# Altium schematic sheet Sheet2.SchDoc
size A0; SheetNumber: 1; SheetTotal: 1
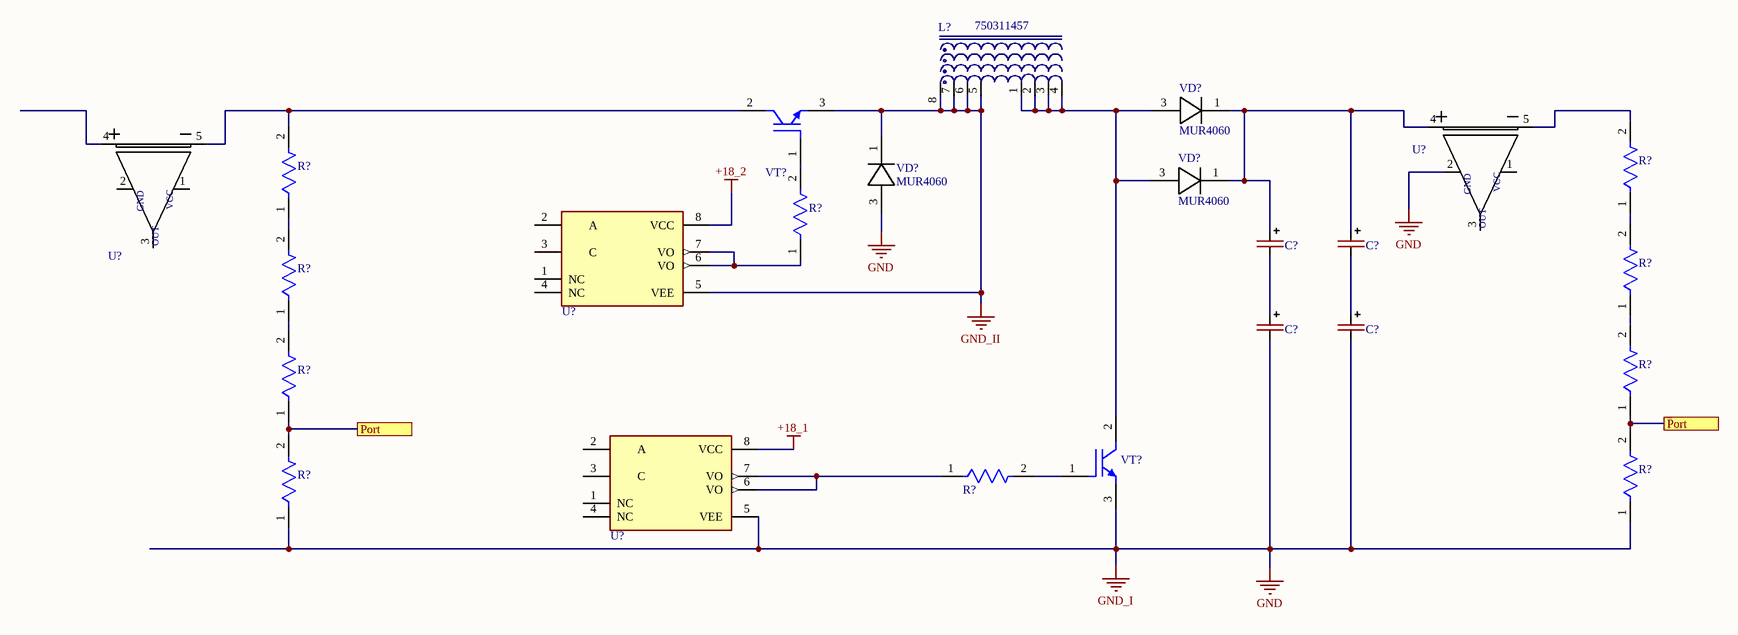
[diagram p0: Sheet2.SchDoc]

## Parts
(Parts that share a designator on the sheet are numbered #1, #2 ... from top to bottom, then left to right.)
C?#1  CAP-POLAR  [CAP 100uF_500V 22x40mm]  (value not drawn)
C?#2  CAP-POLAR  [CAP 100uF_500V 22x40mm]  (value not drawn)
C?#3  CAP-POLAR  [CAP 100uF_500V 22x40mm]  (value not drawn)
C?#4  CAP-POLAR  [CAP 100uF_500V 22x40mm]  (value not drawn)
L?  750311457  [Drossel]
R?#1  RES_1210  [RES_SMD_1210_IPC_B]  (value not drawn)
R?#2  RES_1210  [RES_SMD_1210_IPC_B]  (value not drawn)
R?#3  RES_1210  [RES_SMD_1210_IPC_B]  (value not drawn)
R?#4  RES_1210  [RES_SMD_1210_IPC_B]  (value not drawn)
R?#5  RES_1210  [RES_SMD_1210_IPC_B]  (value not drawn)
R?#6  RES_1210  [RES_SMD_1210_IPC_B]  (value not drawn)
R?#7  RES_1210  [RES_SMD_1210_IPC_B]  (value not drawn)
R?#8  RES_1210  [RES_SMD_1210_IPC_B]  (value not drawn)
R?#9  RES_1210  [RES_SMD_1210_IPC_B]  (value not drawn)
R?#10  RES_1210  [RES_SMD_1210_IPC_B]  (value not drawn)
U?#1  HCPL-3120  [HCPL-3120]  (value not drawn)
U?#2  ACS758  [ACS758-100]  (value not drawn)
U?#3  ACS758  [ACS758-100]  (value not drawn)
U?#4  HCPL-3120  [HCPL-3120]  (value not drawn)
VD?#1  MUR4060  [TO-247-2]
VD?#2  MUR4060  [TO-247-2]
VD?#3  MUR4060  [TO-247-2]
VT?#1  IGBT 60N120T  [TO-264-3]  (value not drawn)
VT?#2  IGBT 60N120T  [TO-264-3]  (value not drawn)

## Ports
Port

## Nets
+18_1: U?#4.8(VCC)
+18_2: U?#1.8(VCC)
GND: C?#3.2(-) C?#4.2(-) R?#9.1 R?#10.1 U?#2.2(GND) U?#4.5(VEE) VD?#3.3 VT?#2.3(E)  [also labelled GND_I]
GND_II: L?.5 L?.6 L?.7 L?.8 U?#1.5(VEE) VD?#3.1 VT?#1.3(E)
Port: R?#6.1 R?#7.1 R?#9.2 R?#10.2 ; port Port
NetC?#1_1: C?#1.1(+) C?#2.1(+) U?#2.4(+IP) VD?#1.1 VD?#2.1
NetC?#1_2: C?#1.2(-) C?#3.1(+)
NetC?#2_2: C?#2.2(-) C?#4.1(+)
NetL?_1: L?.1 L?.2 L?.3 L?.4 VD?#1.3 VD?#2.3 VT?#2.2(C)
NetR?#1_1: R?#1.1 R?#5.2
NetR?#1_2: R?#1.2 U?#2.5(-IP)
NetR?#2_1: R?#2.1 R?#4.2
NetR?#2_2: R?#2.2 U?#3.5(-IP) VT?#1.2(C)
NetR?#3_1: R?#3.1 U?#1.6(VO) U?#1.7(VO)
NetR?#3_2: R?#3.2 VT?#1.1(G)
NetR?#4_1: R?#4.1 R?#6.2
NetR?#5_1: R?#5.1 R?#7.2
NetR?#8_1: R?#8.1 U?#4.6(VO) U?#4.7(VO)
NetR?#8_2: R?#8.2 VT?#2.1(G)

Not connected (* = marked no-connect by the designer): U?#1 1(NC) 2(A) 3(C) 4(NC); U?#2 1(+VCC) 3(OUT); U?#3 1(+VCC) 2(GND) 3(OUT) 4(+IP); U?#4 1(NC) 2(A) 3(C) 4(NC)

## Notes on the sheet
- (in symbol ACS758) VCC

## Library data of the parts
L? = DROSEL: Manufacturer: Wuerth Elektronik; Ui: 36V; ComponentLink1Description: Manufacturer URL; ComponentLink2Description: Datasheet; ComponentLink1URL: http://www.we-online.com; PartNumber: 750311457; PackageReference: EP13; ComponentLink2URL: http://katalog.we-online.de/pbs/datasheet/750311457.pdf
VT?#1 VT?#2 = IGBT 60N120T: IGBT 60N120T TO-264-3